# EAGLE design M617X (EAGLE 6.6.0)
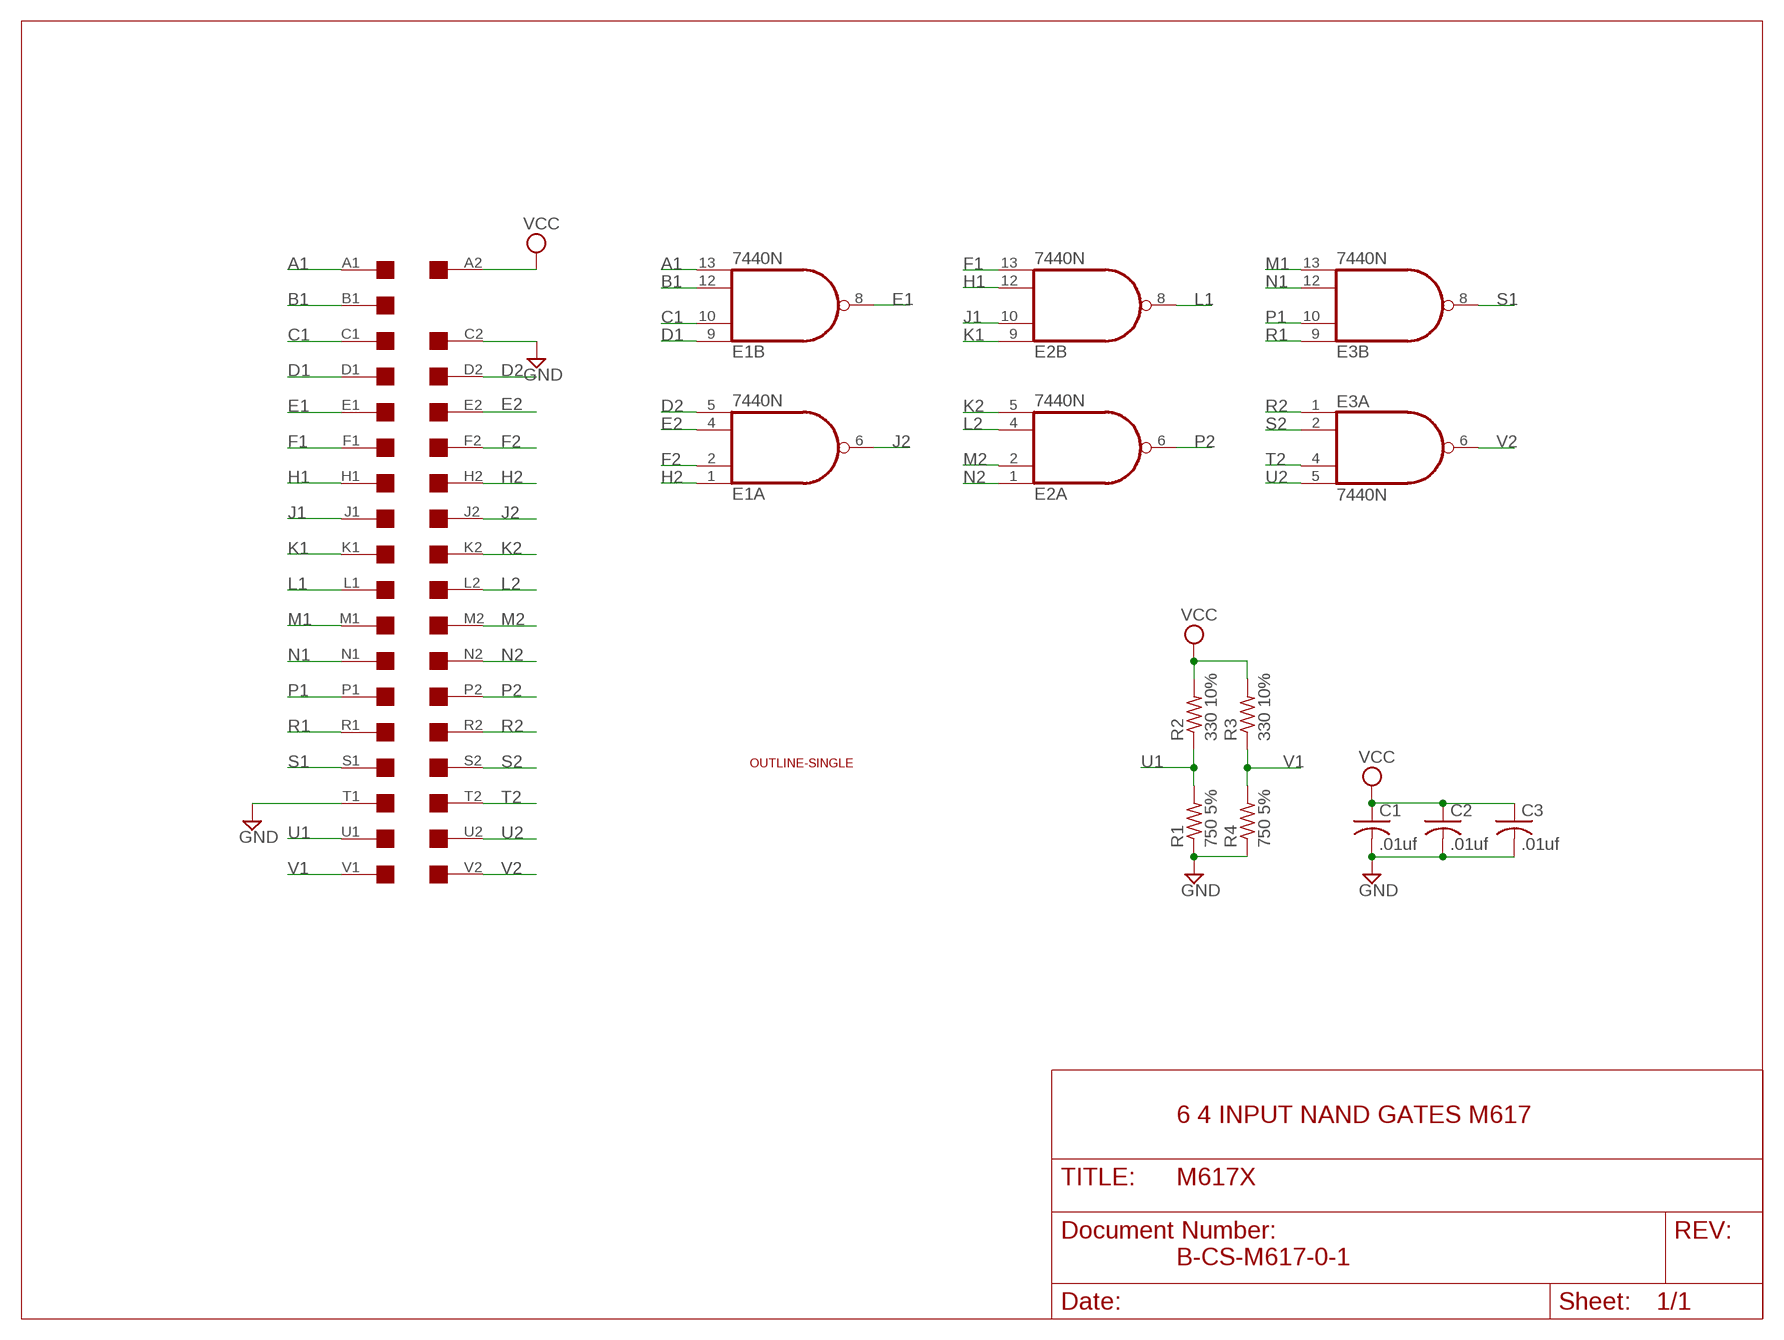
[diagram p0: schematic, sheet 1]

## Parts
C1  .01uf  C-US050-025X075  [C050-025X075]
C2  .01uf  C-US050-025X075  [C050-025X075]
C3  .01uf  C-US050-025X075  [C050-025X075]
E1  7440N  74S20N  [DIL14]
E2  7440N  74S20N  [DIL14]
E3  7440N  74S20N  [DIL14]
R1  750 5%  R-US_0207/10  [0207/10]
R2  330 10%  R-US_0207/10  [0207/10]
R3  330 10%  R-US_0207/10  [0207/10]
R4  750 5%  R-US_0207/10  [0207/10]
U$1  SINGLE  [EDGE-CON2]
U$4  OUTLINE-SINGLE  [SINGLE]

## Nets
A1: E1.13(B:I3) U$1.A1
B1: E1.12(B:I2) U$1.B1
C1: E1.10(B:I1) U$1.C1
D1: E1.9(B:I0) U$1.D1
D2: E1.5(A:I3) U$1.D2
E1: E1.8(B:O) U$1.E1
E2: E1.4(A:I2) U$1.E2
F1: E2.13(B:I3) U$1.F1
F2: E1.2(A:I1) U$1.F2
GND [Supply]: C1.2 C2.2 C3.2 R1.1 R4.1 U$1.C2 U$1.T1
H1: E2.12(B:I2) U$1.H1
H2: E1.1(A:I0) U$1.H2
J1: E2.10(B:I1) U$1.J1
J2: E1.6(A:O) U$1.J2
K1: E2.9(B:I0) U$1.K1
K2: E2.5(A:I3) U$1.K2
L1: E2.8(B:O) U$1.L1
L2: E2.4(A:I2) U$1.L2
M1: E3.13(B:I3) U$1.M1
M2: E2.2(A:I1) U$1.M2
N1: E3.12(B:I2) U$1.N1
N2: E2.1(A:I0) U$1.N2
P1: E3.10(B:I1) U$1.P1
P2: E2.6(A:O) U$1.P2
R1: E3.9(B:I0) U$1.R1
R2: E3.1(A:I0) U$1.R2
S1: E3.8(B:O) U$1.S1
S2: E3.2(A:I1) U$1.S2
T2: E3.4(A:I2) U$1.T2
U1: R1.2 R2.1 U$1.U1
U2: E3.5(A:I3) U$1.U2
V1: R3.1 R4.2 U$1.V1
V2: E3.6(A:O) U$1.V2
VCC [Supply]: C1.1 C2.1 C3.1 R2.2 R3.2 U$1.A2
Unconnected: U$1.B2

## Notes on the sheet
- 6 4 INPUT NAND GATES M617
- B-CS-M617-0-1

## Power pins joined to a net without a drawn wire
GND: E1.7(P:GND) E2.7(P:GND) E3.7(P:GND)
VCC: E1.14(P:VCC) E2.14(P:VCC) E3.14(P:VCC)

## Library data of the parts
C1-C3 = rcl:C-US: CAPACITOR, American symbol
E1-E3 = 74xx-us:74*20: Dual 4-input NAND gate
R1-R4 = rcl:R-US_: RESISTOR, American symbol
U$1 = dec-con:SINGLE: Single-Height DEC board
U$4 = dec-con:OUTLINE-*: Board outlines for DEC boards.

## Net classes
1 Supply: width 0.813 mm

## Board
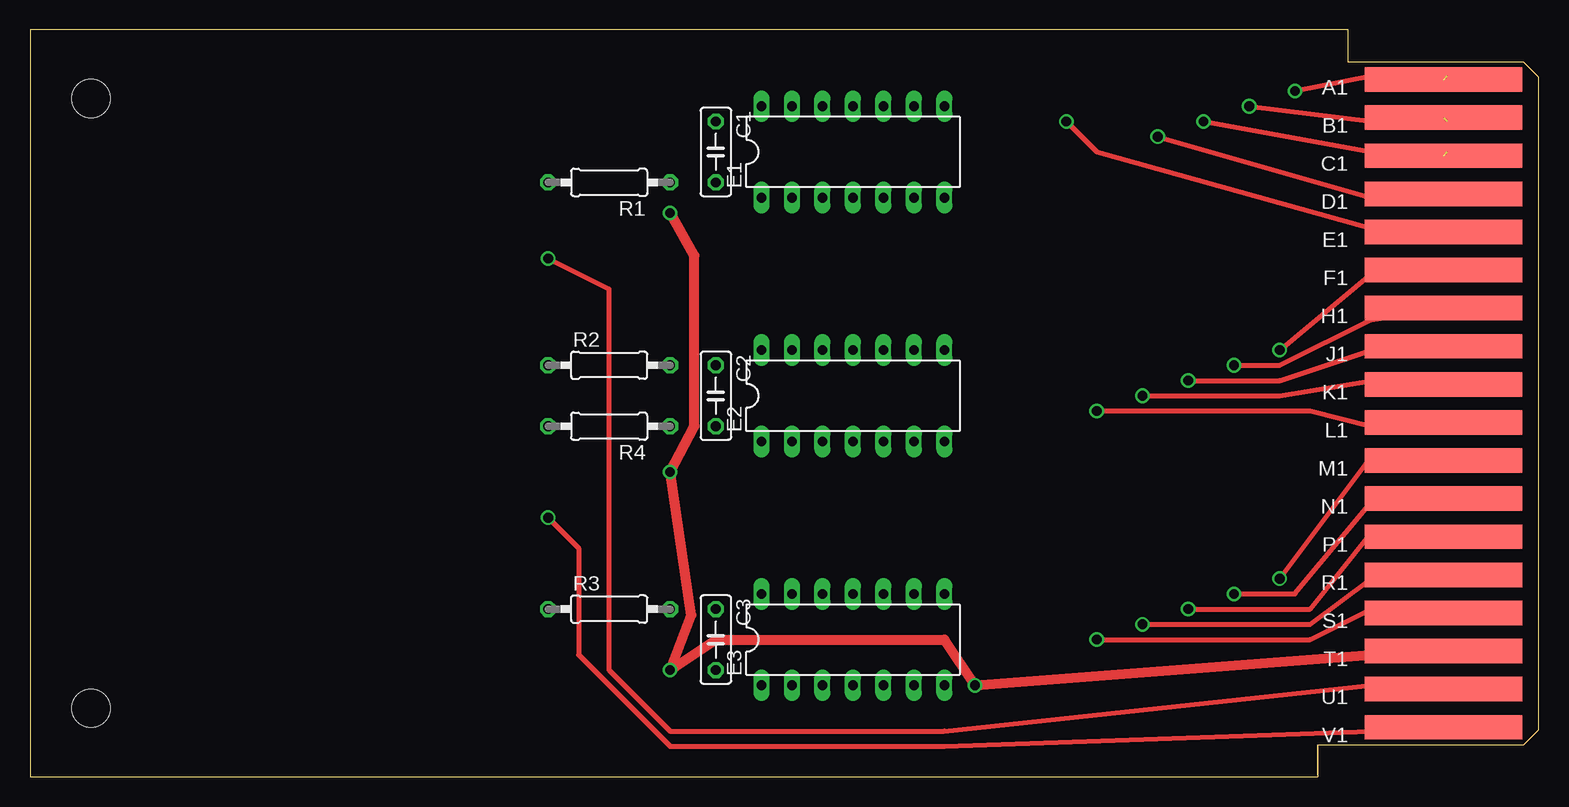
[diagram p1: board, top side]
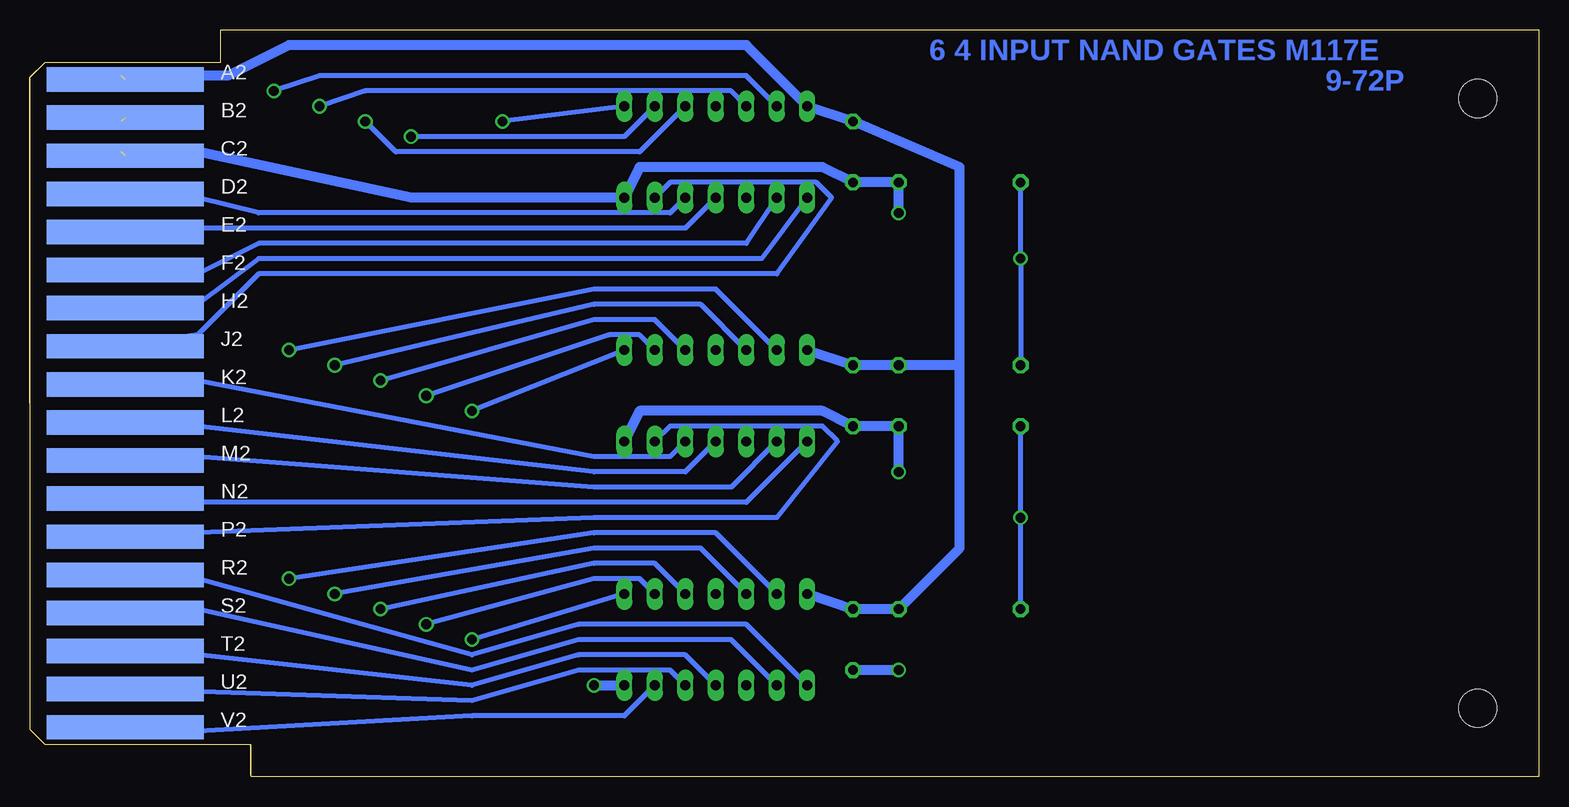
[diagram p2: board, bottom side, seen from below]

Size 125.73 x 62.23 mm. Coordinates in mm from the lower left corner, seen from the top.
Copper layers (1*16): Top 0.035mm / dielectric 1.5mm / Bottom 0.035mm
Design rules "16mils": minimum track width 15mil, minimum drill 24mil, track to track 15mil, track to pad 10mil, pad to pad 10mil, via to via 10mil, smd to smd 10mil, copper to edge 25mil, drill to drill 10mil, minimum pad ring 10mil, minimum via ring 8mil, stop-mask expansion 0mil, vias tented up to drill 0mil, thermal gap 10mil

### Footprints (pad centres in the part's own frame; a part is rotated, then mirrored left to right if it is on the bottom)
C050-025X075 = drill 0.813 octagon: 1 -2.54,0; 2 2.54,0
DIL14 = drill 0.813 long: 1 -7.62,-3.81; 2 -5.08,-3.81; 3 -2.54,-3.81; 4 0,-3.81; 5 2.54,-3.81; 6 5.08,-3.81; 7 7.62,-3.81; 8 7.62,3.81; 9 5.08,3.81; 10 2.54,3.81; 11 0,3.81; 12 -2.54,3.81; 13 -5.08,3.81; 14 -7.62,3.81
0207/10 = drill 0.813 octagon: 1 -5.08,0; 2 5.08,0
EDGE-CON2 = smd 13.106 x 2.032: A1 7.938,4.128; B1 7.938,7.303; C1 7.938,10.477; D1 7.938,13.652; E1 7.938,16.828; F1 7.938,20.003; H1 7.938,23.177; J1 7.938,26.352; K1 7.938,29.527; L1 7.938,32.703; M1 7.938,35.877; N1 7.938,39.053; P1 7.938,42.227; R1 7.938,45.403; S1 7.938,48.578; T1 7.938,51.752; U1 7.938,54.928; V1 7.938,58.102 | smd 13.106 x 2.032 bottom: A2 7.938,4.128; B2 7.938,7.303; C2 7.938,10.477; D2 7.938,13.652; E2 7.938,16.828; F2 7.938,20.003; H2 7.938,23.177; J2 7.938,26.352; K2 7.938,29.527; L2 7.938,32.703; M2 7.938,35.877; N2 7.938,39.053; P2 7.938,42.227; R2 7.938,45.403; S2 7.938,48.578; T2 7.938,51.752; U2 7.938,54.928; V2 7.938,58.102
SINGLE = hole 3.175: 120.65,56.515; 120.65,5.715

### Placement (x,y rotation side)
C1  57.15,52.07 270 top
C2  57.15,31.75 270 top
C3  57.15,11.43 270 top
E1  68.58,52.07 0 top
E2  68.58,31.75 0 top
E3  68.58,11.43 0 top
R1  48.26,49.53 180 top
R2  48.26,34.29 0 top
R3  48.26,13.97 0 top
R4  48.26,29.21 180 top
U$1  125.73,62.23 180 top
U$4  125.73,62.23 180 top

### Tracks (layer width: path | path; a pad name or v marks a point on that pad's centre or on a via)
A1  (via drill 0.81)  (1 unrouted)
  Top 0.406: 118.11,58.42 111.76,58.42 v105.41,57.15
  Bottom 0.406: E1.13 66.04,58.42 101.6,58.42 v105.41,57.15
B1  (via drill 0.81)  (1 unrouted)
  Top 0.406: 118.11,54.61 111.76,54.61 v101.6,55.88
  Bottom 0.406: v101.6,55.88 97.79,57.15 67.31,57.15 E1.12
C1  (via drill 0.81)  (1 unrouted)
  Top 0.406: v97.79,54.61 111.76,52.07 118.11,52.07
  Bottom 0.406: v97.79,54.61 95.25,52.07 74.93,52.07 E1.10
D1  (via drill 0.81)
  Top 0.406: U$1.D1 111.76,48.26 v93.98,53.34
  Bottom 0.406: v93.98,53.34 76.2,53.34 E1.9
D2
  Bottom 0.406: U$1.D2 111.76,48.26 106.68,46.99 72.39,46.99 E1.5
E1  (via drill 0.81)
  Top 0.406: U$1.E1 111.76,45.72 88.9,52.07 v86.36,54.61
  Bottom 0.406: E1.8 v86.36,54.61
E2
  Bottom 0.406: U$1.E2 111.76,45.72 71.12,45.72 E1.4
F1  (via drill 0.81)
  Top 0.406: U$1.F1 111.76,41.91 v104.14,35.56
  Bottom 0.406: v104.14,35.56 78.74,40.64 68.58,40.64 E2.13
F2
  Bottom 0.406: E1.2 66.04,44.45 106.68,44.45 111.76,41.91 U$1.F2
GND  (via drill 0.81)
  Top 0.813: U$1.T1 111.76,10.16 v78.74,7.62 76.2,11.43 57.15,11.43 v53.34,8.89 55.12,13.46 v53.34,25.4 55.37,29.21 55.37,43.43 v53.34,46.99
  Bottom 0.813: v53.34,8.89 C3.2 | v78.74,7.62 E3.7 | v53.34,25.4 R4.1 C2.2 59.69,30.48 74.93,30.48 E2.7 | v53.34,46.99 R1.1 C1.2 59.69,50.8 74.93,50.8 E1.7 93.98,48.26 111.76,52.07 U$1.C2
H1  (via drill 0.81)
  Top 0.406: U$1.H1 111.76,38.1 104.14,34.29 v100.33,34.29
  Bottom 0.406: v100.33,34.29 78.74,39.37 69.85,39.37 E2.12
H2
  Bottom 0.406: U$1.H2 111.76,39.37 106.68,43.18 64.77,43.18 E1.1
J1  (via drill 0.81)
  Top 0.406: U$1.J1 111.76,35.56 104.14,33.02 v96.52,33.02
  Bottom 0.406: v96.52,33.02 78.74,38.1 73.66,38.1 E2.10
J2
  Bottom 0.406: U$1.J2 111.76,36.83 106.68,41.91 63.5,41.91 58.93,48.26 60.2,49.53 72.39,49.53 E1.6
K1  (via drill 0.81)
  Top 0.406: U$1.K1 111.76,33.02 104.14,31.75 v92.71,31.75
  Bottom 0.406: v92.71,31.75 77.47,36.83 74.93,36.83 E2.9
K2
  Bottom 0.406: U$1.K2 111.76,33.02 78.74,26.67 72.39,26.67 E2.5
L1  (via drill 0.81)
  Top 0.406: U$1.L1 111.76,29.21 106.68,30.48 v88.9,30.48
  Bottom 0.406: E2.8 v88.9,30.48
L2
  Bottom 0.406: U$1.L2 111.76,29.21 78.74,25.4 71.12,25.4 E2.4
M1  (via drill 0.81)
  Top 0.406: U$1.M1 111.76,26.67 v104.14,16.51
  Bottom 0.406: v104.14,16.51 78.74,20.32 68.58,20.32 E3.13
M2
  Bottom 0.406: U$1.M2 111.76,26.67 78.74,24.13 67.31,24.13 E2.2
N1  (via drill 0.81)
  Top 0.406: U$1.N1 111.76,22.86 105.41,15.24 v100.33,15.24
  Bottom 0.406: v100.33,15.24 78.74,19.05 69.85,19.05 E3.12
N2
  Bottom 0.406: U$1.N2 111.76,22.86 66.04,22.86 E2.1
P1  (via drill 0.81)
  Top 0.406: U$1.P1 111.76,20.32 106.68,13.97 v96.52,13.97
  Bottom 0.406: v96.52,13.97 78.74,17.78 73.66,17.78 E3.10
P2
  Bottom 0.406: U$1.P2 111.76,20.32 78.74,21.59 63.5,21.59 58.42,27.94 59.69,29.21 72.39,29.21 E2.6
R1  (via drill 0.81)
  Top 0.406: U$1.R1 111.76,16.51 106.68,12.7 v92.71,12.7
  Bottom 0.406: v92.71,12.7 78.74,16.51 74.93,16.51 E3.9
R2
  Bottom 0.406: U$1.R2 111.76,16.51 88.9,10.16 80.01,12.7 66.04,12.7 E3.1
S1  (via drill 0.81)
  Top 0.406: U$1.S1 111.76,13.97 106.68,11.43 v88.9,11.43
  Bottom 0.406: E3.8 v88.9,11.43
S2
  Bottom 0.406: U$1.S2 111.76,13.97 88.9,8.89 80.01,11.43 67.31,11.43 E3.2
T2
  Bottom 0.406: U$1.T2 111.76,10.16 88.9,7.62 80.01,10.16 71.12,10.16 E3.4
U1  (via drill 0.81)
  Top 0.406: U$1.U1 111.76,7.62 76.2,3.81 53.34,3.81 48.26,8.89 48.26,40.64 v43.18,43.18
  Bottom 0.406: R2.1 v43.18,43.18 R1.2
U2
  Bottom 0.406: U$1.U2 88.9,6.35 80.01,8.89 72.39,8.89 E3.5
V1  (via drill 0.81)
  Top 0.406: U$1.V1 111.76,3.81 76.2,2.54 53.34,2.54 45.72,10.16 45.72,19.05 v43.18,21.59
  Bottom 0.406: R3.1 v43.18,21.59 R4.2
V2
  Bottom 0.406: U$1.V2 111.76,3.81 88.9,5.08 76.2,5.08 E3.6
VCC
  Bottom 0.813: U$1.A2 111.76,58.42 109.22,58.42 104.14,60.96 66.04,60.96 E1.14 C1.1 48.26,50.8 48.26,34.29 | 48.26,34.29 R2.2 C2.1 E2.14 | E3.14 C3.1 R3.2 48.26,19.05 48.26,34.29

### Text on the board
Bottom: 6 4 INPUT NAND GATES M117E | 9-72P
Document: Use M117 Etch